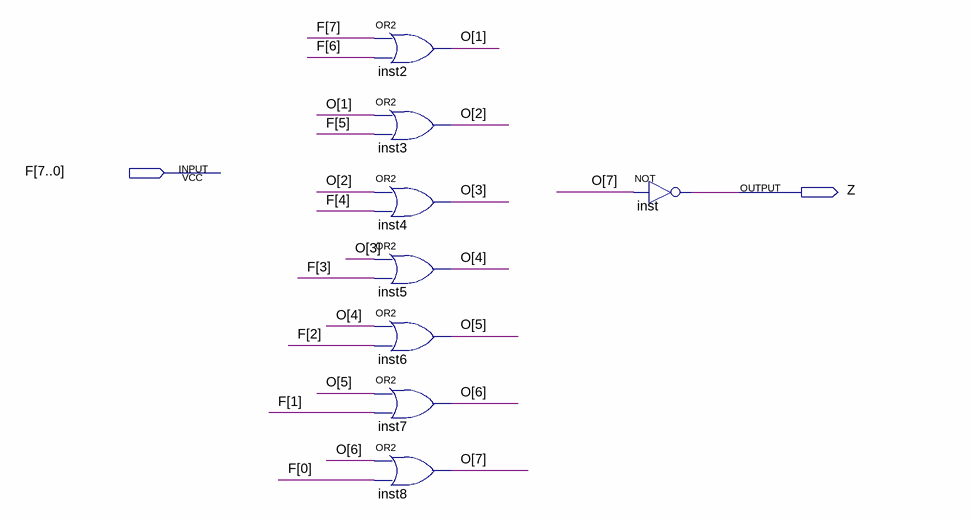
[diagram p0: schematic sheet]
// Quartus schematic ZERO.bdf as structural Verilog: 8 symbols, 2 pins
module ZERO (
  input  [7:0] F,
  output Z
);

  wire [7:1] O;

  or inst2 (O[1], F[7], F[6]);
  or inst3 (O[2], O[1], F[5]);
  or inst4 (O[3], O[2], F[4]);
  or inst5 (O[4], O[3], F[3]);
  or inst6 (O[5], O[4], F[2]);
  or inst7 (O[6], O[5], F[1]);
  or inst8 (O[7], O[6], F[0]);
  not inst (Z, O[7]);
endmodule
